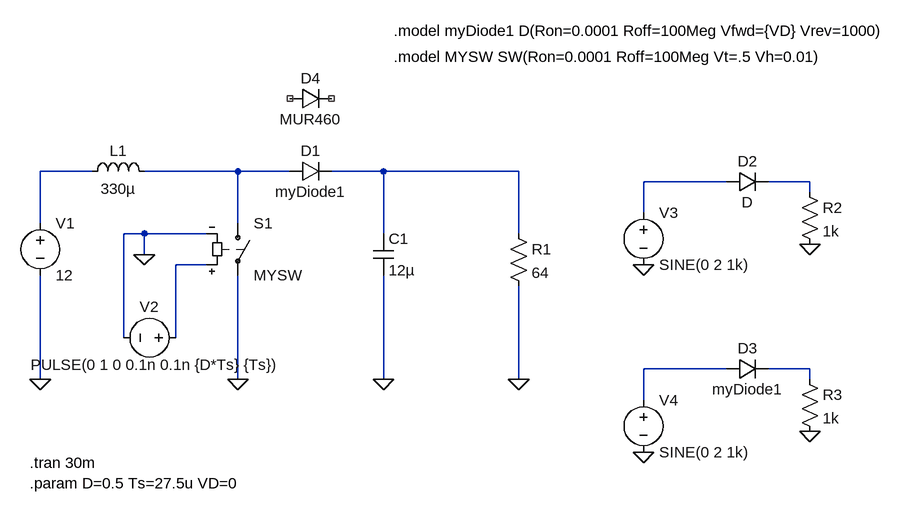
[diagram p0: schematic full_ideal.asc]
full_ideal.asc, the LTspice schematic file:
Version 4.1
SHEET 1 1256 680
WIRE -48 -32 -128 -32
WIRE 176 -32 32 -32
WIRE 256 -32 176 -32
WIRE 400 -32 320 -32
WIRE 608 -32 400 -32
WIRE 928 -16 800 -16
WIRE 1056 -16 992 -16
WIRE 1056 0 1056 -16
WIRE 800 32 800 -16
WIRE -128 48 -128 -32
WIRE 176 48 176 -32
WIRE 32 64 0 64
WIRE 128 64 32 64
WIRE 400 64 400 -32
WIRE 608 64 608 -32
WIRE 32 96 32 64
WIRE 128 112 80 112
WIRE 0 224 0 64
WIRE 80 224 80 112
WIRE 928 272 800 272
WIRE 1056 272 992 272
WIRE -128 288 -128 128
WIRE 176 288 176 128
WIRE 400 288 400 128
WIRE 608 288 608 144
WIRE 1056 288 1056 272
WIRE 800 320 800 272
FLAG 32 96 0
FLAG -128 288 0
FLAG 608 288 0
FLAG 400 288 0
FLAG 176 288 0
FLAG 1056 80 0
FLAG 800 112 0
FLAG 1056 368 0
FLAG 800 400 0
SYMBOL voltage -128 32 R0
WINDOW 123 0 0 Left 0
WINDOW 39 0 0 Left 0
SYMATTR InstName V1
SYMATTR Value 12
SYMBOL ind -64 -16 R270
WINDOW 0 32 56 VTop 2
WINDOW 3 5 56 VBottom 2
SYMATTR InstName L1
SYMATTR Value 330µ
SYMBOL cap 384 64 R0
SYMATTR InstName C1
SYMATTR Value 12µ
SYMBOL res 592 48 R0
SYMATTR InstName R1
SYMATTR Value 64
SYMBOL sw 176 32 R0
SYMATTR InstName S1
SYMATTR Value MYSW
SYMBOL voltage 96 224 R90
WINDOW 0 -32 56 VBottom 2
WINDOW 3 57 47 VBottom 2
WINDOW 123 0 0 Left 0
WINDOW 39 0 0 Left 0
SYMATTR InstName V2
SYMATTR Value PULSE(0 1 0 0.1n 0.1n {D*Ts} {Ts})
SYMBOL diode 256 -16 R270
WINDOW 0 32 32 VTop 2
WINDOW 3 0 32 VBottom 2
SYMATTR InstName D1
SYMATTR Value myDiode1
SYMBOL diode 928 0 R270
WINDOW 0 32 32 VTop 2
WINDOW 3 0 32 VBottom 2
SYMATTR InstName D2
SYMBOL res 1040 -16 R0
SYMATTR InstName R2
SYMATTR Value 1k
SYMBOL voltage 800 16 R0
WINDOW 123 0 0 Left 0
WINDOW 39 0 0 Left 0
SYMATTR InstName V3
SYMATTR Value SINE(0 2 1k)
SYMBOL diode 928 288 R270
WINDOW 0 32 32 VTop 2
WINDOW 3 0 32 VBottom 2
SYMATTR InstName D3
SYMATTR Value myDiode1
SYMBOL res 1040 272 R0
SYMATTR InstName R3
SYMATTR Value 1k
SYMBOL voltage 800 304 R0
WINDOW 123 0 0 Left 0
WINDOW 39 0 0 Left 0
SYMATTR InstName V4
SYMATTR Value SINE(0 2 1k)
SYMBOL diode 256 -128 R270
WINDOW 0 32 32 VTop 2
WINDOW 3 0 32 VBottom 2
SYMATTR InstName D4
SYMATTR Value MUR460
TEXT 416 -208 Left 2 !.model MYSW SW(Ron=0.0001 Roff=100Meg Vt=.5 Vh=0.01)
TEXT -144 416 Left 2 !.tran 30m
TEXT -144 448 Left 2 !.param D=0.5 Ts=27.5u VD=0
TEXT 416 -248 Left 2 !.model myDiode1 D(Ron=0.0001 Roff=100Meg Vfwd={VD} Vrev=1000)

The netlist it stands for:
* full_ideal.asc
V1 N001 0 12
L1 N001 N002 330µ
C1 N003 0 12µ
R1 N003 0 64
S1 N002 0 N006 0 MYSW
V2 N006 0 PULSE(0 1 0 0.1n 0.1n {D*Ts} {Ts})
D1 N002 N003 myDiode1
D2 N004 N005 D
R2 N005 0 1k
V3 N004 0 SINE(0 2 1k)
D3 N007 N008 myDiode1
R3 N008 0 1k
V4 N007 0 SINE(0 2 1k)
D4 NC_01 NC_02 MUR460
.model D D
.lib standard.dio
.model MYSW SW(Ron=0.0001 Roff=100Meg Vt=.5 Vh=0.01)
.tran 30m
.param D=0.5 Ts=27.5u VD=0
.model myDiode1 D(Ron=0.0001 Roff=100Meg Vfwd={VD} Vrev=1000)
.backanno
.end